# Altium schematic sheet IO Peripherals.SchDoc: Peripherals
size A4; DocumentNumber: 4; Revision: D.1(PCB.SCH); SheetNumber: 4; SheetTotal: 7
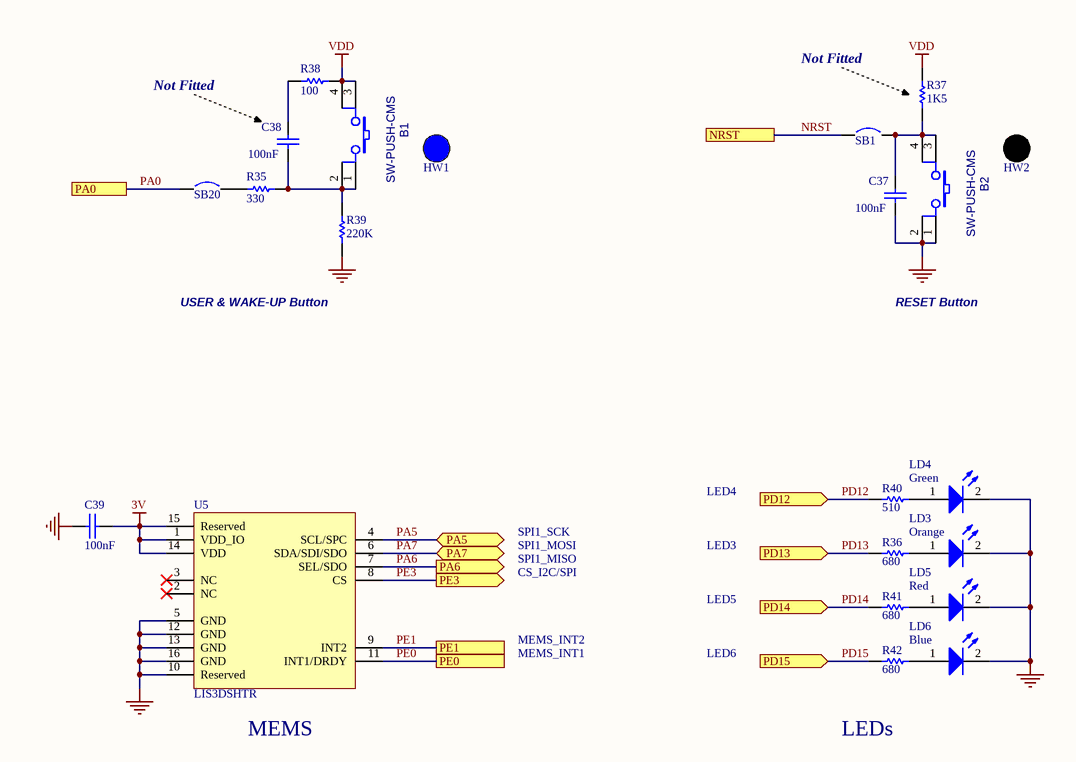
[diagram p0: IO Peripherals.SchDoc]

## Parts
B1  SW-PUSH-CMS  [SW4SMD]
B2  SW-PUSH-CMS  [SW4SMD]
C37  100nF  [0402C]
C38  100nF  [0402C]
C39  100nF  [0402C]
HW1  BUTTON_HAT_BLUE  (value not drawn)  (mechanical)
HW2  BUTTON_HAT_BLACK  (value not drawn)  (mechanical)
LD3  Orange  [LED0603]
LD4  Green  [LED0603]
LD5  Red  [LED0603]
LD6  Blue  [LED0603]
R35  330  [0603R]
R36  680  [0603R]
R37  1K5  [0402R]
R38  100  [0402R]
R39  220K  [0603R]
R40  510  [0603R]
R41  680  [0603R]
R42  680  [0603R]
SB1  Circuit Breaker  [JUMPER]  (value not drawn)
SB20  Circuit Breaker  [JUMPER]  (value not drawn)
U5  LIS3DSHTR  [LGA16_]

## Ports
NRST, PA0, PA5 (bidir), PA6 (out), PA7 (bidir), PD12 (in), PD13 (in), PD14 (in), PD15 (in), PE0, PE1, PE3 (out)

## Nets
3V: C39.2 U5.1(VDD_IO) U5.14(VDD) U5.15(Reserved)
GND: B2.1 B2.2 C37.1 C39.1 LD3.2(K) LD4.2(K) LD5.2(K) LD6.2(K) R39.1 U5.5(GND) U5.10(Reserved) U5.12(GND) U5.13(GND) U5.16(GND)
VDD: B1.3 B1.4 R37.2 R38.2
NRST: SB1.1 ; port NRST
PA0: SB20.1 ; port PA0
PA5: U5.4(SCL/SPC) ; port PA5
PA6: U5.7(SEL/SDO) ; port PA6
PA7: U5.6(SDA/SDI/SDO) ; port PA7
PD12: R40.2 ; port PD12
PD13: R36.2 ; port PD13
PD14: R41.2 ; port PD14
PD15: R42.2 ; port PD15
PE0: U5.11(INT1/DRDY) ; port PE0
PE1: U5.9(INT2) ; port PE1
PE3: U5.8(CS) ; port PE3
NetB1_1: B1.1 B1.2 C38.1 R35.2 R39.2
NetB2_3: B2.3 B2.4 C37.2 R37.1 SB1.2
NetC38_2: C38.2 R38.1
NetLD3_1: LD3.1(A) R36.1
NetLD4_1: LD4.1(A) R40.1
NetLD5_1: LD5.1(A) R41.1
NetLD6_1: LD6.1(A) R42.1
NetR35_1: R35.1 SB20.2

Not connected (* = marked no-connect by the designer): U5 2(NC)* 3(NC)*

## Notes on the sheet
- Not Fitted
- USER & WAKE-UP Button
- RESET Button
- LED4
- SPI1_MOSI
- SPI1_SCK
- SPI1_MISO
- CS_I2C/SPI
- LED3
- MEMS_INT2
- LED5
- MEMS_INT1
- LED6
- (near U5) MEMS
- LEDs
- Title:
- Project:
- Size:
- Revision:
- Variant:
- A4
- -
- Date:
- Reference:
- Sheet:
- of

## Library data of the parts
B1 = SW-PUSH-CMS_NEW: Non-Open Push-Button 0.1A 24V; Manuf_1: CHAU-HUA; Manuf_Part_1: CTSM-644B-V-T/R; cap_dec: ---
B2 = SW-PUSH-CMS_NEW: Non-Open Push-Button 0.1A 24V; Manuf_1: CHAU-HUA; Manuf_Part_1: CTSM-644N-V-T/R; cap_dec: ---
C37 C39 = CAP: Capacitor; Manuf_Part_1: CC0402KRX7R7BB104; Manuf_1: YAGEO; Value: 100nF
  C37: Published: 8-Jun-2000; Revision: July-2002: Re-released for DXP Platform.; Publisher: Altium Limited
C38 = CAP: Capacitor; Fitted: NO; Published: 8-Jun-2000; Revision: July-2002: Re-released for DXP Platform.; Publisher: Altium Limited; Value: 100nF
HW1 = BUTTON_HAT_BLUE: switch hat,blue; Manuf_Part_1: KTSC-62B; Manuf_1: CHAU-HUA
HW2 = BUTTON_HAT_BLACK: switch hat,black; Manuf_1: CHAU-HUA; Manuf_Part_1: KTSC-62K
LD3 = LED2: Typical RED, GREEN, YELLOW, AMBER GaAs LED; Manuf_Part_1: 19-217/S2C-AM2N2VY/3T; Manuf_1: EVERLIGHT; Published: 8-Jun-2000; Revision: July-2002: Re-released for DXP Platform.; Publisher: Altium Limited
LD4 = LED2: Typical RED, GREEN, YELLOW, AMBER GaAs LED; Manuf_1: EVERLIGHT; Manuf_Part_1: 19-213SYGC/S530-E2/TR8; Published: 8-Jun-2000; Revision: July-2002: Re-released for DXP Platform.; Publisher: Altium Limited
LD5 = LED2: Typical RED, GREEN, YELLOW, AMBER GaAs LED; Manuf_Part_1: 19-213-R6C-AP1Q2B-3T; Manuf_1: EVERLIGHT; Published: 8-Jun-2000; Revision: July-2002: Re-released for DXP Platform.; Publisher: Altium Limited
LD6 = LED2: Typical RED, GREEN, YELLOW, AMBER GaAs LED; Manuf_1: EVERLIGHT; Manuf_Part_1: 19-217/BHC-ZL1M2RY/3T; Published: 8-Jun-2000; Revision: July-2002: Re-released for DXP Platform.; Publisher: Altium Limited
R35 = res1: Resistor; Manuf_Part_1: RC0603FR-07330RL; Manuf_1: YAGEO; Published: 8-Jun-2000; Revision: July-2002: Re-released for DXP Platform.; Publisher: Altium Limited; Value: 330
R36 R41 R42 = Res1: Resistor; Manuf_Part_1: RC0603FR-07680RL; Manuf_1: YAGEO; Published: 8-Jun-2000; Revision: July-2002: Re-released for DXP Platform.; Publisher: Altium Limited; Value: 680
R37 = res1: Resistor; Manuf_Part_1: RC0402FR-071K5L; Manuf_1: YAGEO; Fitted: NO; Published: 8-Jun-2000; Revision: July-2002: Re-released for DXP Platform.; Publisher: Altium Limited; Value: 1K5
R38 = res1: Resistor; Manuf_Part_1: RC0402FR-07100RL; Manuf_1: YAGEO; Published: 8-Jun-2000; Revision: July-2002: Re-released for DXP Platform.; Publisher: Altium Limited; Value: 100
R39 = res1: Resistor; Manuf_Part_1: RC0603FR-07220KL; Manuf_1: YAGEO; Published: 8-Jun-2000; Revision: July-2002: Re-released for DXP Platform.; Publisher: Altium Limited; Value: 220K
R40 = Res1: Resistor; Manuf_Part_1: RC0603FR-07510RL; Manuf_1: YAGEO; Published: 8-Jun-2000; Revision: July-2002: Re-released for DXP Platform.; Publisher: Altium Limited; Value: 510
SB1 SB20 = Circuit Breaker: Solder: YES; Published: 24-Mar-1999; Revision: July-2002: Re-released for DXP Platform.; Publisher: Altium Limited
U5 = LIS3DSH_: MEMS motion sensor 3-axis - ±2g/±4g/±6g/±8g/±16g digital output accelerometer; Manuf_1: STM; Provided: ST; ref St: to be created; Manuf_Part_1: LIS3DSHTR; Distrib: STM; Footprint: LGA16(3*3); Order: LIS3DSHTR